# EAGLE design GrblControllerPi (EAGLE 6.4)
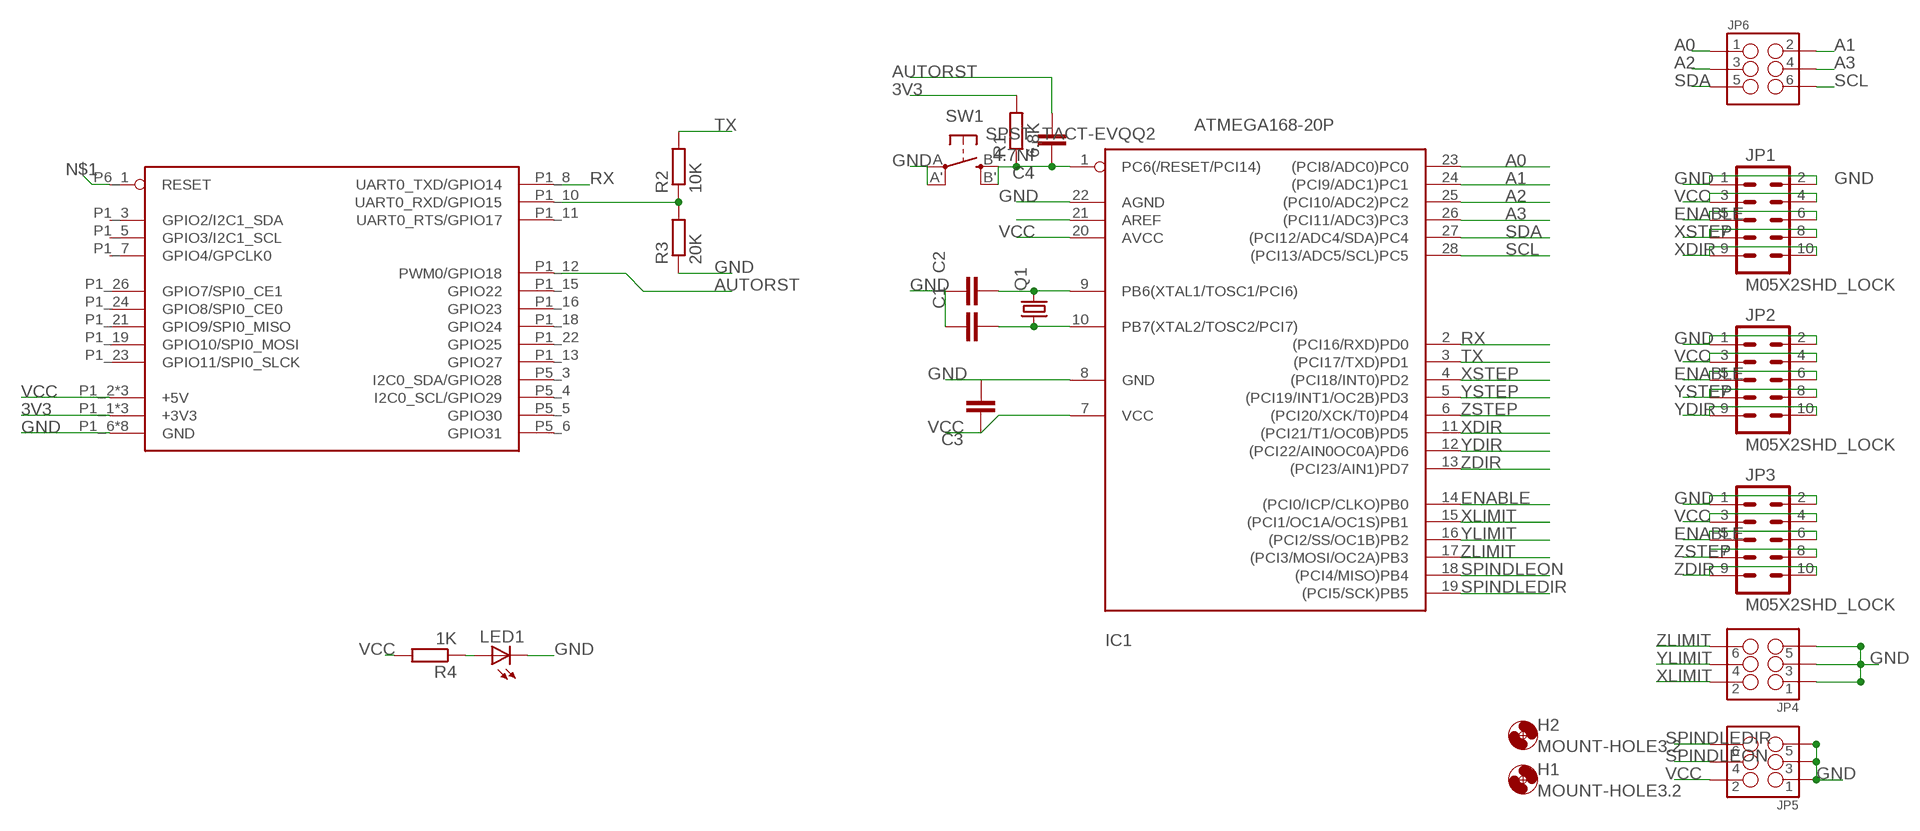
[diagram p0: schematic, sheet 1]

## Parts
C1  CAPACITOR_NPOL-1206  [C1206]
C2  CAPACITOR_NPOL-1206  [C1206]
C3  CAPACITOR_NPOL-1206  [C1206]
C4  4.7Nf  CAPACITOR_NPOL-1206  [C1206]
H1  MOUNT-HOLE3.2  [3,2]
H2  MOUNT-HOLE3.2  [3,2]
IC1  ATMEGA168-20P  [DIL28-3]
JP1  M05X2SHD_LOCK  [2X5-SHROUDED_LOCK]
JP2  M05X2SHD_LOCK  [2X5-SHROUDED_LOCK]
JP3  M05X2SHD_LOCK  [2X5-SHROUDED_LOCK]
JP4  M03X2SHROUD  [2X3-SHROUDED]
JP5  M03X2SHROUD  [2X3-SHROUDED]
JP6  M03X2SHROUD  [2X3-SHROUDED]
LED1  LEDCHIPLED_1206  [CHIPLED_1206]
Q1  CRYSTALHC49UP  [HC49UP]
R1  6.8K  RESISTOR-1206  [R1206]
R2  10K  RESISTOR-1206  [R1206]
R3  20K  RESISTOR-1206  [R1206]
R4  1K  RESISTOR-1206  [R1206]
SW1  SPST_TACT-EVQQ2  [EVQ-Q2]
U$1  RPI-B-V2SHIELD  [RPI-B-V2-SHIELD]

## Nets
3V3: R1.2 U$1.P1_1(+3V3) U$1.P1_17(+3V3) U$1.P5_2(+3V3)
A0: IC1.23((PCI8/ADC0)PC0) JP6.1
A1: IC1.24((PCI9/ADC1)PC1) JP6.2
A2: IC1.25((PCI10/ADC2)PC2) JP6.3
A3: IC1.26((PCI11/ADC3)PC3) JP6.4
AUTORST: C4.2 U$1.P1_12(PWM0/GPIO18)
ENABLE: IC1.14((PCI0/ICP/CLKO)PB0) JP1.5 JP1.6 JP2.5 JP2.6 JP3.5 JP3.6
GND: C1.1 C2.1 C3.2 IC1.8(GND) IC1.22(AGND) JP1.1 JP1.2 JP2.1 JP2.2 JP3.1 JP3.2 JP4.1 JP4.3 JP4.5 JP5.1 JP5.3 JP5.5 LED1.C R3.1 SW1.A'(P1) SW1.A(P) U$1.P1_6(GND) U$1.P1_9(GND) U$1.P1_14(GND) U$1.P1_20(GND) U$1.P1_25(GND) U$1.P5_7(GND) U$1.P5_8(GND) U$1.P6_2(GND)
MCURESET: C4.1 IC1.1(PC6(/RESET/PCI14)) R1.1 SW1.B'(S1) SW1.B(S)
N$1: U$1.P6_1(RESET)
N$2: LED1.A R4.1
N$26: IC1.21(AREF)
RX: IC1.2((PCI16/RXD)PD0) U$1.P1_8(UART0_TXD/GPIO14)
SCL: IC1.28((PCI13/ADC5/SCL)PC5) JP6.6
SDA: IC1.27((PCI12/ADC4/SDA)PC4) JP6.5
SPINDLEDIR: IC1.19((PCI5/SCK)PB5) JP5.6
SPINDLEON: IC1.18((PCI4/MISO)PB4) JP5.4
TX: IC1.3((PCI17/TXD)PD1) R2.2
TX3V3: R2.1 R3.2 U$1.P1_10(UART0_RXD/GPIO15)
VCC: C3.1 IC1.7(VCC) IC1.20(AVCC) JP1.3 JP1.4 JP2.3 JP2.4 JP3.3 JP3.4 JP5.2 R4.2 U$1.P1_2(+5V) U$1.P1_4(+5V) U$1.P5_1(+5V)
XDIR: IC1.11((PCI21/T1/OC0B)PD5) JP1.9 JP1.10
XLIMIT: IC1.15((PCI1/OC1A/OC1S)PB1) JP4.2
XSTEP: IC1.4((PCI18/INT0)PD2) JP1.7 JP1.8
XTAL1: C2.2 IC1.9(PB6(XTAL1/TOSC1/PCI6)) Q1.2
XTAL2: C1.2 IC1.10(PB7(XTAL2/TOSC2/PCI7)) Q1.1
YDIR: IC1.12((PCI22/AIN0OC0A)PD6) JP2.9 JP2.10
YLIMIT: IC1.16((PCI2/SS/OC1B)PB2) JP4.4
YSTEP: IC1.5((PCI19/INT1/OC2B)PD3) JP2.7 JP2.8
ZDIR: IC1.13((PCI23/AIN1)PD7) JP3.9 JP3.10
ZLIMIT: IC1.17((PCI3/MOSI/OC2A)PB3) JP4.6
ZSTEP: IC1.6((PCI20/XCK/T0)PD4) JP3.7 JP3.8
Unconnected: U$1.P1_3(GPIO2/I2C1_SDA) U$1.P1_5(GPIO3/I2C1_SCL) U$1.P1_7(GPIO4/GPCLK0) U$1.P1_11(UART0_RTS/GPIO17) U$1.P1_13(GPIO27) U$1.P1_15(GPIO22) U$1.P1_16(GPIO23) U$1.P1_18(GPIO24) U$1.P1_19(GPIO10/SPI0_MOSI) U$1.P1_21(GPIO9/SPI0_MISO) U$1.P1_22(GPIO25) U$1.P1_23(GPIO11/SPI0_SLCK) U$1.P1_24(GPIO8/SPI0_CE0) U$1.P1_26(GPIO7/SPI0_CE1)

## Power pins joined to a net without a drawn wire
GPIO30: U$1.P5_5(GPIO30)
GPIO31: U$1.P5_6(GPIO31)
I2C0_SCL/GPIO29: U$1.P5_4(I2C0_SCL/GPIO29)
I2C0_SDA/GPIO28: U$1.P5_3(I2C0_SDA/GPIO28)

## Library data of the parts
C1-C4 = dp_devices:CAPACITOR_NPOL: Non-Polarized capacitor in various packages
H1 H2 = holes:MOUNT-HOLE: MOUNTING HOLE with drill center marker
IC1 = adafruit:ATMEGA168*P: MICROCONTROLLER 16 kBytes FLASH 1 kBytes SRAM 512 Bytes EEPROM USART 8-channel 10 bit ADC
JP1-JP3 = SparkFun-Connectors:M05X2: Header 5x2 Standard 10-pin dual row 0.1" header. Commonly used with AVR-ISP. Use with Spark Fun Electronics SKU: PRT-00778
JP4-JP6 = SparkFun-Connectors:M03X2: 2x3 .1" header. Shrouded, with keying- CONN-10681 SMT- CONN-11415 Pogo pins- HW-11044; PROD_ID: CONN-10681
LED1 = adafruit:LED: LED OSRAM: - CHIPLED LG R971, LG N971, LY N971, LG Q971, LY Q971, LO R971, LY R971 LH N974, LH R974 LS Q976, LO Q976, LY Q976 LO Q996 - Hyper CHIPLED LW Q18S LB Q993, LB Q99A, LB R99A - SideLED LS A670, LO A670, LY A670, LG A670, LP A670 LB A673, LV A673, LT A673, LW A673 LH A674 LY A675 LS A676, LA A676, LO A676, LY A676, LW A676 LS A679, LY A679, LG A679 - Hyper Micro SIDELED® LS Y876, LA Y876, LO Y876, LY Y876 LT Y87S - SmartLED LW L88C, LW L88S LB L89C, LB L89S, LG L890 LS L89K, LO L89K, LY L89K LS L896, LA L896, LO L896, LY L896 - TOPLED LS T670, LO T670, LY T670, LG T670, LP T670 LSG T670, LSP T670, LSY T670, LOP T670, LYG T670 LG T671, LOG T671, LSG T671 LB T673, LV T673, LT T673, LW T673 LH T674 LS T676, LA T676, LO T676, LY T676, LB T676, LH T676, LSB T676, LW T676 LB T67C, LV T67C, LT T67C, LS T67K, LO T67K, LY T67K, LW E67C LS E67B, LA E67B, LO E67B, LY E67B, LB E67C, LV E67C, LT E67C LW T67C LS T679, LY T679, LG T679 LS T770, LO T770, LY T770, LG T770, LP T770 LB T773, LV T773, LT T773, LW T773 LH T774 LS E675, LA E675, LY E675, LS T675 LS T776, LA T776, LO T776, LY T776, LB T776 LHGB T686 LT T68C, LB T68C - Hyper Mini TOPLED® LB M676 - Mini TOPLED Santana® LG M470 LS M47K, LO M47K, LY M47K Source: http://www.osram.convergy.de/
Q1 = adafruit:CRYSTAL: CRYSTAL; OC_FARNELL: unknown; OC_NEWARK: unknown
R1-R4 = dp_devices:RESISTOR
SW1 = adafruit:SPST_TACT: SMT 6mm switch, EVQQ2 series http://www.ladyada.net/library/eagle
U$1 = raspberry:RPI-B-V2: Second revision of the Model 2 board including the P5 and P6 headers. Mounting holes have been added. Choose the "SHIELD" variant for a predefined Dimension layer and drilling holes. Theres also a "SHIELD" variant for the Model A without a RJ45 connector.

## Board
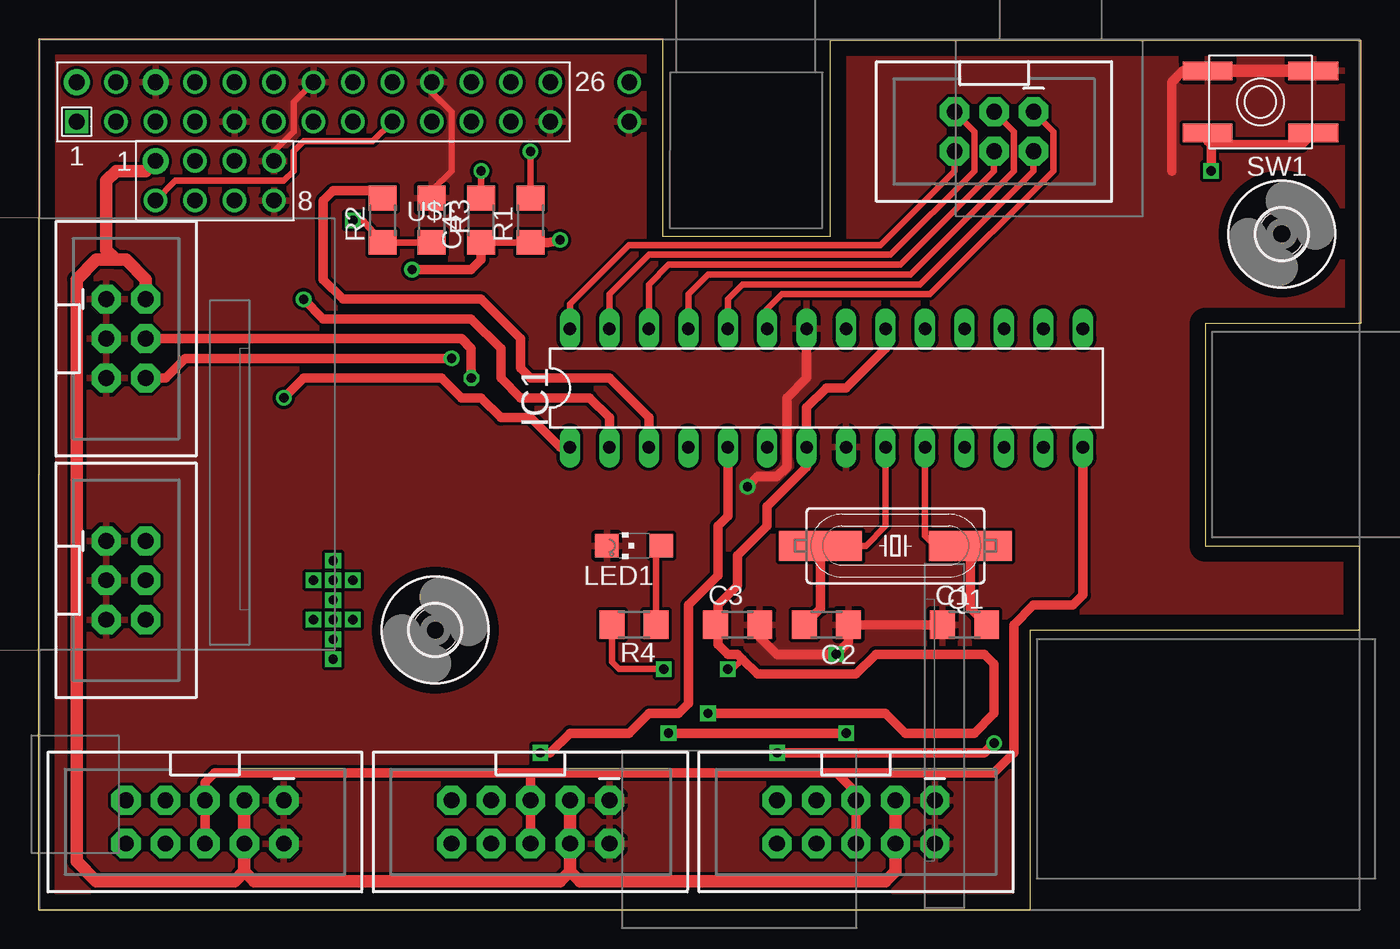
[diagram p1: board, top side]
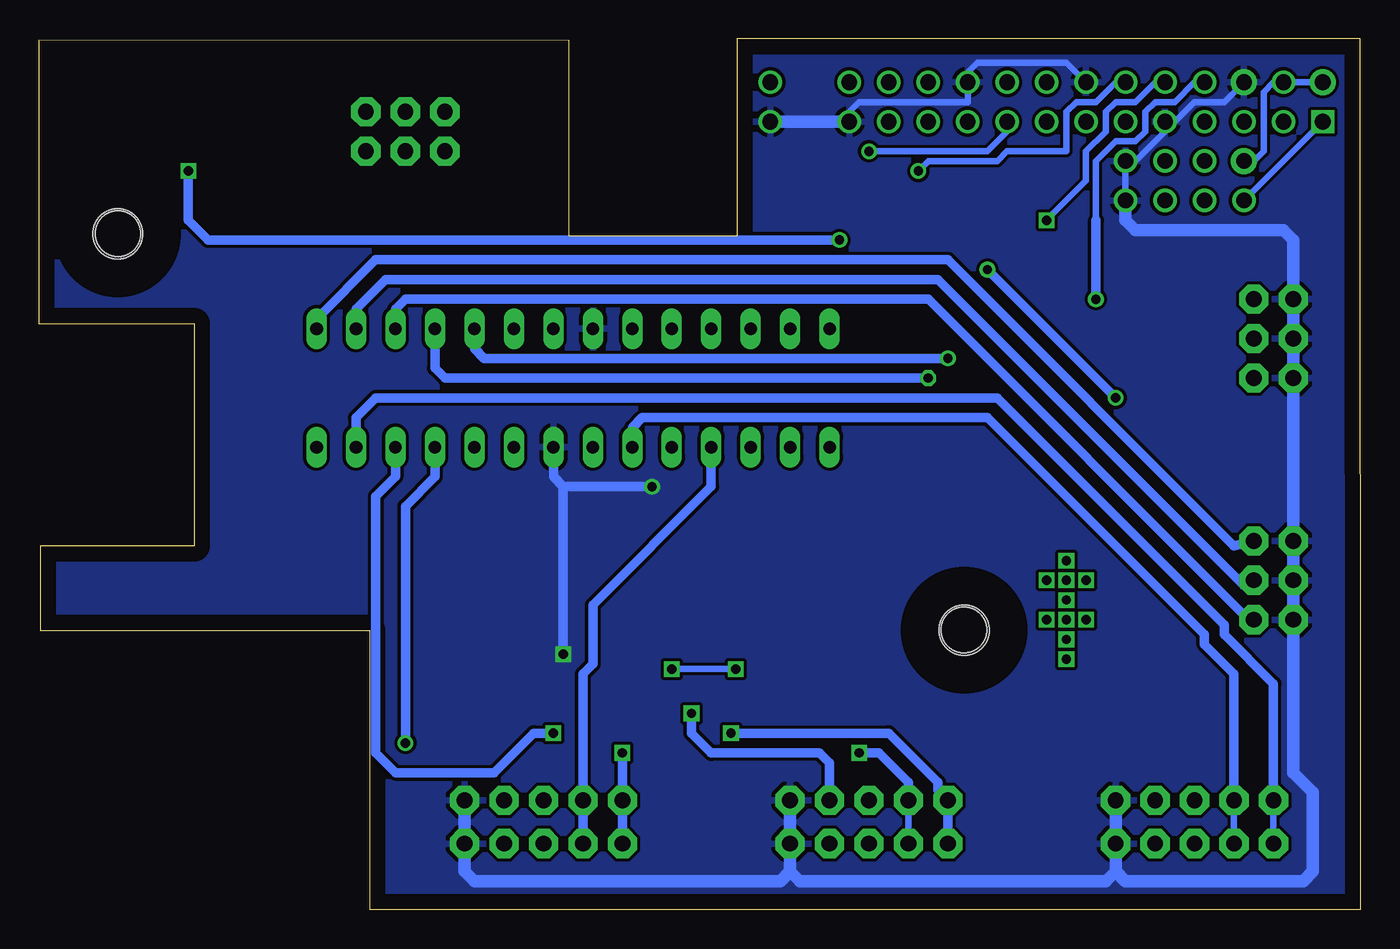
[diagram p2: board, bottom side, seen from below]

Size 85.09 x 56.09 mm. Coordinates in mm from the lower left corner, seen from the top.
Copper layers (1*16): Top 0.035mm / dielectric 1.5mm / Bottom 0.035mm
Design rules "default": minimum track width 10mil, minimum drill 24mil, track to track 8mil, track to pad 8mil, pad to pad 8mil, via to via 8mil, smd to smd 8mil, copper to edge 40mil, drill to drill 8mil, minimum pad ring 10mil, minimum via ring 8mil, stop-mask expansion 4mil, vias tented up to drill 0mil, thermal gap 10mil

### Footprints (pad centres in the part's own frame; a part is rotated, then mirrored left to right if it is on the bottom)
C1206 = smd 1.6 x 1.803: 1 -1.422,0; 2 1.422,0
3,2 = hole 3.2: 0,0
DIL28-3 = drill 0.813 long: 1 -16.51,-3.81; 2 -13.97,-3.81; 3 -11.43,-3.81; 4 -8.89,-3.81; 5 -6.35,-3.81; 6 -3.81,-3.81; 7 -1.27,-3.81; 8 1.27,-3.81; 9 3.81,-3.81; 10 6.35,-3.81; 11 8.89,-3.81; 12 11.43,-3.81; 13 13.97,-3.81; 14 16.51,-3.81; 15 16.51,3.81; 16 13.97,3.81; 17 11.43,3.81; 18 8.89,3.81; 19 6.35,3.81; 20 3.81,3.81; 21 1.27,3.81; 22 -1.27,3.81; 23 -3.81,3.81; 24 -6.35,3.81; 25 -8.89,3.81; 26 -11.43,3.81; 27 -13.97,3.81; 28 -16.51,3.81
2X5-SHROUDED_LOCK = drill 1.016 pad 1.88 octagon: 1 -1.397,5.08; 2 1.397,5.08; 3 -1.397,2.54; 4 1.397,2.54; 5 -1.397,0; 6 1.397,0; 7 -1.397,-2.54; 8 1.397,-2.54; 9 -1.397,-5.08; 10 1.397,-5.08
2X3-SHROUDED = drill 1.016 pad 1.88 octagon: 1 -1.27,2.54; 2 1.27,2.54; 3 -1.27,0; 4 1.27,0; 5 -1.27,-2.54; 6 1.27,-2.54
CHIPLED_1206 = smd 1.5 x 1.5: A 0,-1.75; C 0,1.75
HC49UP = smd 5.334 x 1.93: 1 -4.826,0; 2 4.826,0
R1206 = smd 1.6 x 1.803: 1 -1.422,0; 2 1.422,0
EVQ-Q2 = smd 3.2 x 1.2: A -3.4,-2; A' 3.4,-2; B -3.4,2; B' 3.4,2
RPI-B-V2-SHIELD = drill 1 square: P1_1 0,0 | drill 1 pad 1.676: P1_2 0,2.54; P1_6 5.08,2.54; P5_1 5.08,-2.54 | drill 1: P1_3 2.54,0; P1_4 2.54,2.54; P1_5 5.08,0; P1_7 7.62,0; P1_8 7.62,2.54; P1_9 10.16,0; P1_10 10.16,2.54; P1_11 12.7,0; P1_12 12.7,2.54; P1_13 15.24,0; P1_14 15.24,2.54; P1_15 17.78,0; P1_16 17.78,2.54; P1_17 20.32,0; P1_18 20.32,2.54; P1_19 22.86,0; P1_20 22.86,2.54; P1_21 25.4,0; P1_22 25.4,2.54; P1_23 27.94,0; P1_24 27.94,2.54; P1_25 30.48,0; P1_26 30.48,2.54; P5_2 5.08,-5.08; P5_3 7.62,-2.54; P5_4 7.62,-5.08; P5_5 10.16,-2.54; P5_6 10.16,-5.08; P5_7 12.7,-2.54; P5_8 12.7,-5.08; P6_1 35.56,2.54; P6_2 35.56,0 | hole 2.9: 23.1,-32.72; 77.57,-7.21

### Placement (x,y rotation side)
C1  59.59,18.37 0 top
C2  50.7,18.37 180 top
C3  44.98,18.37 0 top
C4  28.47,44.41 90 top
H1  25.52,18.02 0 top
H2  80.02,43.53 0 top
IC1  50.7,33.61 0 top
JP1  52.6,5.67 270 top
JP2  31.65,5.67 270 top
JP3  10.69,5.67 270 top
JP4  5.61,21.23 0 top
JP5  5.61,36.79 0 top
JP6  61.49,50.12 270 top
LED1  38.32,23.45 90 top
Q1  55.14,23.45 180 top
R1  31.65,44.41 90 top
R2  22.12,44.41 90 top
R3  25.3,44.41 270 top
R4  38.32,18.37 180 top
SW1  78.64,52.03 180 top
U$1  2.44,50.76 0 top

### Tracks (layer width: path | path; a pad name or v marks a point on that pad's centre or on a via)
3V3  (via drill 0.6)
  Top 0.406: U$1.P5_2 8.79,46.95 15.77,46.95 16.41,47.58 16.41,48.85 17.04,49.49 21.49,49.49 U$1.P1_17 | R1.2 v31.65,48.85
  Bottom 0.406: U$1.P1_1 U$1.P5_2 | v31.65,48.85 24.03,48.85 22.76,50.12 U$1.P1_17
A0
  Top 0.406: IC1.23 46.89,38.69 47.84,39.64 57.37,39.64 65.3,47.58 65.3,50.12 JP6.1
A1
  Top 0.406: IC1.24 44.35,39.33 45.3,40.28 56.73,40.28 64.03,47.58 JP6.2
A2
  Top 0.406: IC1.25 41.81,39.64 43.08,40.91 56.1,40.91 62.76,47.58 62.76,50.12 JP6.3
A3
  Top 0.406: IC1.26 39.27,40.28 40.54,41.55 55.46,41.55 61.49,47.58 JP6.4
AUTORST  (via drill 0.6)
  Top 0.406: v28.47,47.58 C4.2
  Bottom 0.406: U$1.P1_12 15.77,53.3 17.04,52.03 18.31,52.03 18.95,51.39 18.95,48.85 22.76,48.85 23.39,48.22 27.84,48.22 v28.47,47.58
ENABLE
  Top 0.61: JP3.6 JP3.5 10.69,8.21 11.33,8.85 31.65,8.85 | 31.65,8.85 51.33,8.85 | 51.33,8.85 52.6,7.58 JP1.5 JP1.6 | JP2.6 JP2.5 31.65,8.85 | 51.33,8.85 61.49,8.85 62.76,10.12 62.76,18.37 64.03,19.64 66.57,19.64 67.21,20.28 IC1.14
GND  (via drill 0.6)
  Top 0.406: R3.1 25.3,46.31 26.57,47.58 26.57,51.39 25.3,52.66 U$1.P1_20 | U$1.P5_7 15.14,48.85 16.41,50.12 16.41,52.03 U$1.P1_14
  Top 0.61: C1.1 C2.1 52.12,17.25 v51.33,16.47 47.52,16.47 46.41,17.58 C3.2 | IC1.22 49.43,34.25 48.16,32.98 48.16,28.53 47.52,27.9 46.25,27.9 v45.62,27.26 | SW1.A' 73.65,54.03 72.92,53.3 72.92,47.58
  Top 0.813: SW1.A' SW1.A
  Bottom 0.406: U$1.P1_25 32.92,51.39 32.28,52.03 25.3,52.03 U$1.P1_20 25.3,53.93 24.66,54.57 18.95,54.57 U$1.P1_14 | U$1.P1_6 8.79,52.03 10.69,52.03 11.96,50.76 U$1.P1_9 12.6,50.12 14.5,48.22 U$1.P5_7 U$1.P5_8
  Bottom 0.61: v51.33,16.47 51.33,27.26 | 51.33,27.26 51.97,27.9 IC1.8 | v45.62,27.26 51.33,27.26
  Bottom 0.813: U$1.P1_25 U$1.P6_2 | U$1.P5_8 15.14,44.41 14.5,43.77 4.98,43.77 4.34,43.14 JP5.1 JP5.3 JP5.5 JP4.1 JP4.3 JP4.5 4.34,8.85 3.07,7.58 3.07,2.5 3.71,1.86 15.14,1.86 15.77,2.5 | 15.77,2.5 JP3.2 JP3.1 | 15.77,2.5 16.41,1.86 36.09,1.86 36.73,2.5 | 36.73,2.5 JP2.2 JP2.1 | 36.73,2.5 37.36,1.86 57.05,1.86 57.68,2.5 JP1.2 JP1.1
  pour Top: -0.74,57.42 -0.74,-0.36 0.22,-1.31 85.31,-1.31 86.89,0.27 86.89,55.84 85.31,57.42
  pour Bottom: -1.37,57.74 85.94,57.74 86.89,56.79 86.89,-0.04 84.99,-1.95 0.22,-1.95 -1.37,-0.36
MCURESET  (via drill 0.6)
  Top 0.406: C4.1 R1.1
  Top 0.61: IC1.1 33.55,29.8 31.65,31.71 29.74,31.71 28.47,32.98 27.2,32.98 25.93,34.25 17.04,34.25 v15.77,32.98 | v24.03,41.23 27.84,41.23 28.47,41.87 C4.1 | R1.1 32.77,42.98 v33.55,43.14 | v75.46,47.58 75.46,49.27 | SW1.B' 75.24,49.5 75.46,49.27 | 75.46,49.27 81.29,49.27 SW1.B
  Bottom 0.61: v15.77,32.98 v24.03,41.23 | v33.55,43.14 74.19,43.14 75.46,44.41 v75.46,47.58
N$2
  Top 0.406: R4.1 39.74,23.12 LED1.A
N$3  (via drill 0.6)
  other vias: 18.95,22.5
N$4  (via drill 0.6)
  other vias: 18.95,21.23
N$5  (via drill 0.6)
  other vias: 17.68,21.23
N$6  (via drill 0.6)
  other vias: 20.22,21.23
N$7  (via drill 0.6)
  other vias: 18.95,19.96
N$8  (via drill 0.6)
  other vias: 17.68,18.69
N$9  (via drill 0.6)
  other vias: 20.22,18.69
N$10  (via drill 0.6)
  other vias: 18.95,17.42
N$11  (via drill 0.6)
  other vias: 18.95,18.69
N$12  (via drill 0.6)
  other vias: 18.95,16.15
RX  (via drill 0.6)
  Top 0.61: IC1.2 36.73,31.71 35.46,32.98 31.01,32.98 29.74,34.25 29.74,36.15 27.84,38.06 18.31,38.06 v17.04,39.33
  Bottom 0.406: U$1.P1_8 10.69,53.3 11.96,52.03 13.23,52.03 13.87,51.39 13.87,50.12 14.5,49.49 15.77,49.49 17.04,48.22 17.04,44.41
  Bottom 0.61: v17.04,39.33 17.04,44.41
SCL
  Top 0.406: IC1.28 34.19,39.01 38,42.82 54.19,42.82 58.95,47.58 JP6.6
SDA
  Top 0.406: IC1.27 36.73,39.64 39.27,42.18 54.83,42.18 60.22,47.58 60.22,50.12 JP6.5
SPINDLEDIR  (via drill 0.6)
  Top 0.61: v26.57,35.52 9.42,35.52 8.15,34.25 JP5.6
  Bottom 0.61: IC1.19 57.05,36.15 56.41,35.52 v26.57,35.52
SPINDLEON  (via drill 0.6)
  Top 0.61: JP5.4 27.2,36.79 27.84,36.15 v27.84,34.25
  Bottom 0.61: IC1.18 59.59,34.88 58.95,34.25 v27.84,34.25
TX
  Top 0.61: IC1.3 39.27,31.71 36.73,34.25 31.65,34.25 31.01,34.88 31.01,36.79 28.47,39.33 19.58,39.33 18.31,40.6 18.31,45.68 18.95,46.31 21.64,46.31 R2.2
TX3V3  (via drill 0.6)
  Top 0.406: v20.22,44.41 20.85,44.41 21.97,43.14 R2.1 R3.2
  Bottom 0.406: U$1.P1_10 13.23,53.3 14.5,52.03 15.77,52.03 16.41,51.39 16.41,50.12 17.68,48.85 17.68,46.95 v20.22,44.41
VCC  (via drill 0.6)
  Top 0.406: v44.35,15.51 44.67,15.51 45.3,16.15 | R4.2 36.89,15.98 37.36,15.51 v40.22,15.51
  Top 0.61: 43.56,18.52 43.71,17.89 | 43.71,17.89 43.08,17.89 C3.1 43.71,18.52 43.71,19.64 44.98,20.91 44.98,22.82 46.89,24.72 46.89,25.99 49.43,28.53 IC1.7 49.43,32.34 50.7,33.61 51.97,33.61 54.51,36.15 IC1.20 | v43.08,12.66 54.51,12.66 55.78,11.39 60.22,11.39 61.49,12.66 61.49,15.83 60.86,16.47 53.87,16.47 52.6,15.2 46.25,15.2 45.3,16.15 44.98,16.47 44.35,16.47 43.71,17.1 43.71,17.89
  Top 0.813: 4.98,41.87 5.61,41.87 6.88,40.6 JP5.2 | 4.98,41.87 4.34,42.5 4.34,46.95 4.98,47.58 6.88,47.58 U$1.P5_1 | 4.98,41.87 3.71,41.87 2.44,40.6 2.44,3.13 3.71,1.86 12.6,1.86 13.23,2.5 | 13.23,2.5 JP3.4 JP3.3 | 13.23,2.5 13.87,1.86 33.55,1.86 34.19,2.5 | 34.19,2.5 JP2.4 JP2.3 | 34.19,2.5 34.82,1.86 54.51,1.86 55.14,2.5 JP1.4 JP1.3
  Bottom 0.406: U$1.P1_2 U$1.P1_4 5.61,53.3 6.25,52.66 6.25,48.85 6.88,48.22 U$1.P5_1 | v40.22,15.51 v44.35,15.51
  Bottom 0.61: JP2.3 34.19,9.48 34.82,10.12 41.81,10.12 43.08,11.39 v43.08,12.66
XDIR  (via drill 0.6)
  Top 0.61: v47.52,10.12 60.86,10.12 v61.49,10.75
  Bottom 0.61: JP1.10 JP1.9 v47.52,10.12 | v61.49,10.75 61.49,25.99 59.59,27.9 IC1.11
XLIMIT
  Bottom 0.61: IC1.15 67.21,38.06 63.4,41.87 26.57,41.87 8.15,23.45 JP4.2
XSTEP
  Bottom 0.61: JP1.8 JP1.7 50.06,15.2 49.43,15.83 49.43,19.64 41.81,27.26 IC1.4
XTAL1
  Top 0.406: IC1.9 54.51,24.72 53.24,23.45 Q1.2
  Top 0.61: Q1.2 50.32,19.41 C2.2
XTAL2
  Top 0.406: IC1.10 57.05,24.09 57.68,23.45 Q1.1
  Top 0.61: Q1.1 59.97,19.41 C1.2
YDIR  (via drill 0.6)
  Top 0.61: v51.97,11.39 v40.54,11.39
  Bottom 0.61: JP2.10 JP2.9 27.2,7.7 27.2,8.21 30.38,11.39 v40.54,11.39 | IC1.12 62.13,27.9 63.4,26.63 63.4,10.12 62.13,8.85 55.78,8.85 53.24,11.39 v51.97,11.39
YLIMIT
  Bottom 0.61: IC1.16 64.67,38.69 62.76,40.6 27.2,40.6 7.52,20.91 JP4.4
YSTEP  (via drill 0.6)
  Top 0.61: v32.28,10.12 32.92,10.12 34.19,11.39 38,11.39 39.27,12.66 41.17,12.66 41.81,13.29 41.81,19.64 43.71,21.55 43.71,24.72 44.35,25.36 IC1.5
  Bottom 0.406: JP2.7 JP2.8
  Bottom 0.61: JP2.7 29.11,8.21 31.01,10.12 v32.28,10.12
ZDIR
  Bottom 0.406: JP3.9 JP3.10
  Bottom 0.61: JP3.9 5.61,14.56 8.79,17.74 8.79,18.37 23.39,32.98 63.4,32.98 64.67,31.71 IC1.13
ZLIMIT
  Bottom 0.61: IC1.17 62.13,38.69 61.49,39.33 27.84,39.33 7.2,18.69 JP4.6
ZSTEP
  Bottom 0.406: JP3.7 JP3.8
  Bottom 0.61: JP3.7 8.15,15.2 10.06,17.1 10.06,17.74 24.03,31.71 46.25,31.71 46.89,31.07 IC1.6

### Text on the board
OPENHWSILK: SDA | A2 | A0 | raspberry pi | SCL | A3 | A1 | RESET AVR | gnd | CC-BY-NC | 5V | 10K | 20K | 4N7 | 6k8 | SPINDLE-EN | SPINDIR | ATMEGA328P | (2014) | GrblPI | 16Mhz | CNC | Control | XEND | LED | YEND | 1K | 0.1u | 22p | 22p | wiki. | openhardware. | co.za | ZEND | POWER | DIR | STP | ENA | 5V | GND | Z | DIR | STP | ENA | 5V | GND | Y | DIR | STP | ENA | 5V | GND | X